# Altium schematic sheet negativeRail.SchDoc
size A; SheetNumber: 2; SheetTotal: 4; SPICEModelCacheHJSHHYSY: <root> / <DocumentId>HJSHHYSY</DocumentId> / </root>
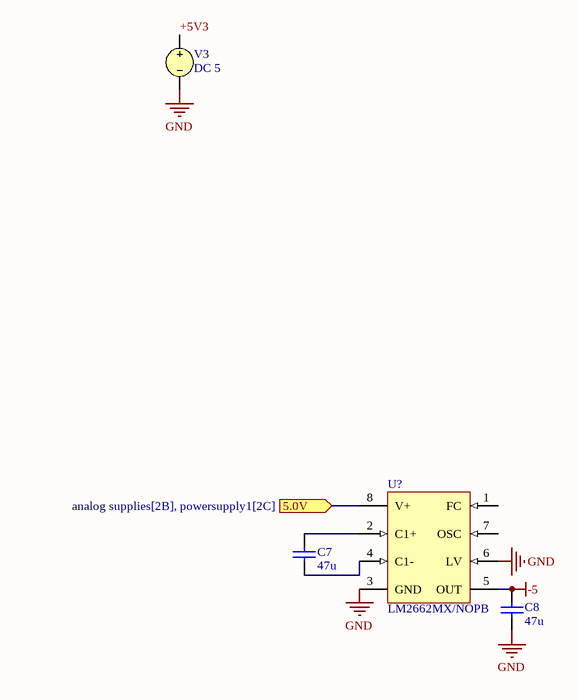
[diagram p0: negativeRail.SchDoc]

## Parts
C7  value 47u  (hidden comment: Capacitor)
C8  value 47u  (hidden comment: Capacitor)
U?  LM2662MX/NOPB  [D0008A_M]
V3  DC 5

## Ports
5.0V (in, see analog supplies[2B], powersupply1[2C])

## Nets
-5: C8.2 U?.5(OUT)
GND: C8.1 U?.3(GND) U?.6(LV) V3.2
5.0V: U?.8(V+) ; port 5.0V
+5V3: V3.1
NetC7_1: C7.1 U?.4(C1-)
NetC7_2: C7.2 U?.2(C1+)

Not connected (* = marked no-connect by the designer): U? 1(FC) 7(OSC)

## Library data of the parts
C7 C8 = Capacitor: SimulationGenericComponent: True
U? = CMP-0065-00025-3: Switched Capacitor Voltage Converter, 8-pin Narrow SOIC, Pb-Free; Manufacturer: Texas Instruments; PowerWise: N; CompType: Switch Caps; PackageTopMarking: NSZXTT*LM26*62M; PackageReference: D0008A; PinCount: 8; RoHS: Y; ComponentLink1URL: http://www.ti.com/general/docs/lit/getliterature.tsp?genericPartNumber=LM2662&fileType=pdf; Code_IPC: SOIC127P600-8; ComponentLink1Description: Datasheet URL; PackageDescription: SOIC Narrow, 4.9 x 3.9 x 1.45mm, 8 Lead, 1.27mm Pitch; Code_JEDEC: MS-012-AA
V3 = VSRC: Voltage Source; Note: PCB Footprint - Not required; AC Magnitude: 1; AC Phase: 0; Value: 5; Published: 8-Jun-2000; LatestRevisionDate: 17-Jul-2002; LatestRevisionNote: Re-released for DXP Platform.; PackageReference: Not Applicable; Publisher: Altium Limited